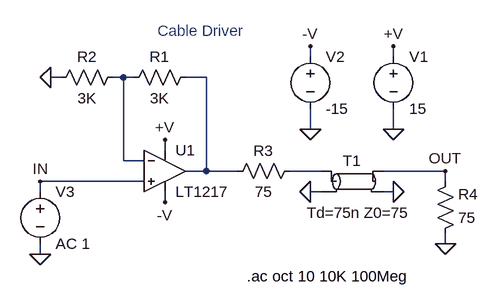
[diagram p0: schematic 1217.asc]
1217.asc, the LTspice schematic file:
Version 4
SHEET 1 896 680
WIRE 416 64 416 48
WIRE 544 64 544 48
WIRE 32 96 16 96
WIRE 128 96 112 96
WIRE 144 96 128 96
WIRE 256 96 224 96
WIRE 416 176 416 144
WIRE 544 176 544 144
WIRE 192 208 192 192
WIRE 128 224 128 96
WIRE 160 224 128 224
WIRE 256 240 256 96
WIRE 256 240 224 240
WIRE 304 240 256 240
WIRE 432 240 384 240
WIRE 624 240 528 240
WIRE 160 256 0 256
WIRE 624 256 624 240
WIRE 0 272 0 256
WIRE 432 272 416 272
WIRE 544 272 528 272
WIRE 192 288 192 272
WIRE 624 352 624 336
WIRE 0 368 0 352
FLAG 544 176 0
FLAG 192 192 +V
FLAG 544 48 +V
FLAG 192 288 -V
FLAG 416 176 0
FLAG 416 48 -V
FLAG 16 96 0
FLAG 0 368 0
FLAG 624 352 0
FLAG 416 272 0
FLAG 544 272 0
FLAG 624 240 OUT
FLAG 0 256 IN
SYMBOL voltage 544 48 R0
SYMATTR InstName V1
SYMATTR Value 15
SYMBOL voltage 416 48 R0
SYMATTR InstName V2
SYMATTR Value -15
SYMBOL res 240 80 R90
WINDOW 0 0 56 VBottom 0
WINDOW 3 32 56 VTop 0
SYMATTR InstName R1
SYMATTR Value 3K
SYMBOL res 128 80 R90
WINDOW 0 0 56 VBottom 0
WINDOW 3 32 56 VTop 0
SYMATTR InstName R2
SYMATTR Value 3K
SYMBOL voltage 0 256 R0
SYMATTR InstName V3
SYMATTR Value AC 1
SYMBOL opamps\\LT1217 192 176 R0
SYMATTR InstName U1
SYMBOL res 400 224 R90
WINDOW 0 0 56 VBottom 0
WINDOW 3 32 56 VTop 0
SYMATTR InstName R3
SYMATTR Value 75
SYMBOL res 608 352 M180
WINDOW 0 36 76 Left 0
WINDOW 3 36 40 Left 0
SYMATTR InstName R4
SYMATTR Value 75
SYMBOL tline 480 256 R0
WINDOW 3 -69 48 Left 0
SYMATTR Value Td=75n Z0=75
SYMATTR InstName T1
TEXT 318 402 Left 0 !.ac oct 10 10K 100Meg
TEXT 248 40 Bottom 0 ;Cable Driver

The netlist it stands for:
* 1217.asc
V1 +V 0 15
V2 -V 0 -15
R1 N002 N001 3K
R2 N001 0 3K
V3 IN 0 AC 1
XU1 IN N001 +V -V N002 LT1217  ; pins In+ In- V+ V- OUT
R3 N003 N002 75
R4 0 OUT 75
T1 N003 0 OUT 0 Td=75n Z0=75
.ac oct 10 10K 100Meg
* Cable Driver
.backanno
.end